# Altium project WCE_Programming_board.PrjPcb
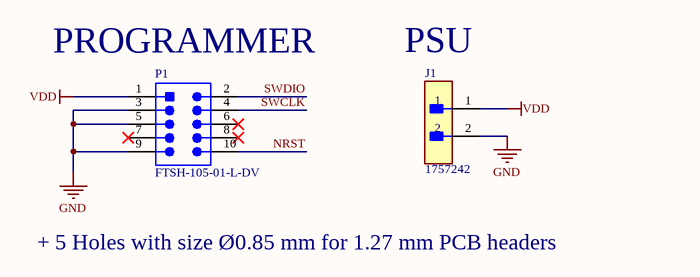
[diagram p0: WCE_Programming.SchDoc]
1 sheet, 2 parts. Net scope: global (net labels, ports and power ports of the same name join across sheets).
Board file: WCE_Programming.PcbDoc

## Sheet WCE_Programming.SchDoc
size A; SheetNumber: 1; SheetTotal: 1

### Parts
J1  1757242  [FP-1757242-MFG]
P1  FTSH-105-01-L-DV  [SMTC-FTSH-105-01-L-DV_V]

### Nets
GND: J1.2 P1.3 P1.5 P1.9
VDD: J1.1 P1.1
NRST: P1.10
SWCLK: P1.4
SWDIO: P1.2

Not connected (* = marked no-connect by the designer): P1 6* 7* 8*

### Notes on the sheet
- (near P1) PROGRAMMER
- (near J1) PSU
- + 5 Holes with size Ø0.85 mm for 1.27 mm PCB headers

### Library data of the parts
J1 = CMP-09399-000010-1: TERM BLOCK HDR 2POS 90DEG 5.08MM; Number of Poles: 2; Voltage Rating (DC): 320V; Number of Levels: 1; Voltage Rating: 250V; Current: 15A; Gender: Male; Current Rating: 12A; Voltage: 300V; Approvals: UL; Connector Type: Plug; Package Quantity: 50; Weight: 5.396916oz; Mount: Through Hole; Lead Free: Lead Free; Depth: 12mm; Contact Plating: Tin; Housing Material: PBT; Color: Grey; REACH SVHC: No SVHC; Number of Contacts: 2; Flammability Rating: UL94 V-0; Length: 12.16mm; Housing Color: Green; RoHS Compliant: Yes; Contact Material: Tin; Height: 12.08mm; Orientation: Right Angle; Termination: Solder; Pitch: 5.08mm; Number of Positions: 2; Packaging: Bulk; Number of Rows: 1; Number of Positions Per Level: 2; Width: 12.1mm; Max Current Rating: 12A; Series: MSTBA
P1 = CMP-2000-05354-1: Male Header, Pitch 1.27 mm, 2 x 5 Position, Height 5.96 mm, -55 to 125 degC, RoHS, Bulk; Manufacturer: Samtec; Connector Type: Header,Unshrouded; Pitch: 0.050"(1.27mm); Mating Products: FLE-105-01-G-DV-TR-ND-CONNSKT1.27MM10POSDUALSMDCLP-105-02-G-D-P-TR-ND-CONNRCPT10POSDUAL.05"SMDSFMC-105-L2-S-D-TR-ND-CONN.05"SURFACE10POSSMTSFMH-105-02-L-D-TR-ND-CONNRECEPT10POS.50"SMTFLE-105-01-G-DV-A-ND-CONNSKT1.27MM10POSDUALSMDCLP-105-02-G-D-BE-ND-CONNRCPT10POSDUAL.05"SMDFLE-105-01-G-DV-A-P-ND-CONNSKT1.27MM10POSDUALSMDSAM1153-05-ND-CONNRCPT10POSDUAL.05"SMDSAM1155-05-ND-CONNRCPT10POSDUAL.05"SMDSAM1154-05-ND-CONNRCPT10POSDUAL.05"SMDSFMH-105-02-L-D-LC-ND-CONNRECEPT10POS.50"SMTSAM1226-05-ND-CONNRCPT.05"10POSDUALSMD; Catalog Drawings: FTSHSeriesFTSHSeriesSMTSide; Other Names: SAM1161-05; EDA / CAD Models: DownloadfromAcceleratedDesigns; Number of Positions Loaded: All; Number of Positions: 10; Featured Product: Board-To-BoardInterconnectSystems; Online Catalog: FTSHSeries; Product Training Modules: Board-to-BoardConnectors; Category: Connectors,Interconnects; Number of Rows: 2; Contact Finish: Gold; Termination: Solder; Mounting Type: SurfaceMount; Series: FTSH; Contact Mating Length: 0.120"(3.05mm); Row Spacing: 0.050"(1.27mm); Datasheet URL: https://datasheet.ciiva.com/30493/0900766b80adfe36-30493006.pdf; Contact Finish Thickness: 10µin(0.25µm); Features: -; Standard Package: 1; Packaging: Bulk; Datasheet Version: Feb-08; Manufacturer URL: http://www.samtec.com/; Fastening Type: -; Family: RectangularConnectors-Headers,MalePins; Contact Type: MalePin; Color: Black